# Altium schematic sheet CoilHolder.SchDoc
size A
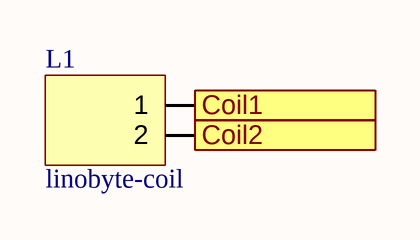
[diagram p0: CoilHolder.SchDoc]

## Parts
L1  linobyte-coil  [linobyte-coil]

## Ports
Coil1 (out), Coil2 (out)

## Nets
Coil1: L1.1 ; port Coil1
Coil2: L1.2 ; port Coil2